# EAGLE design IronDriverInterfaceRevA (EAGLE 6.1)
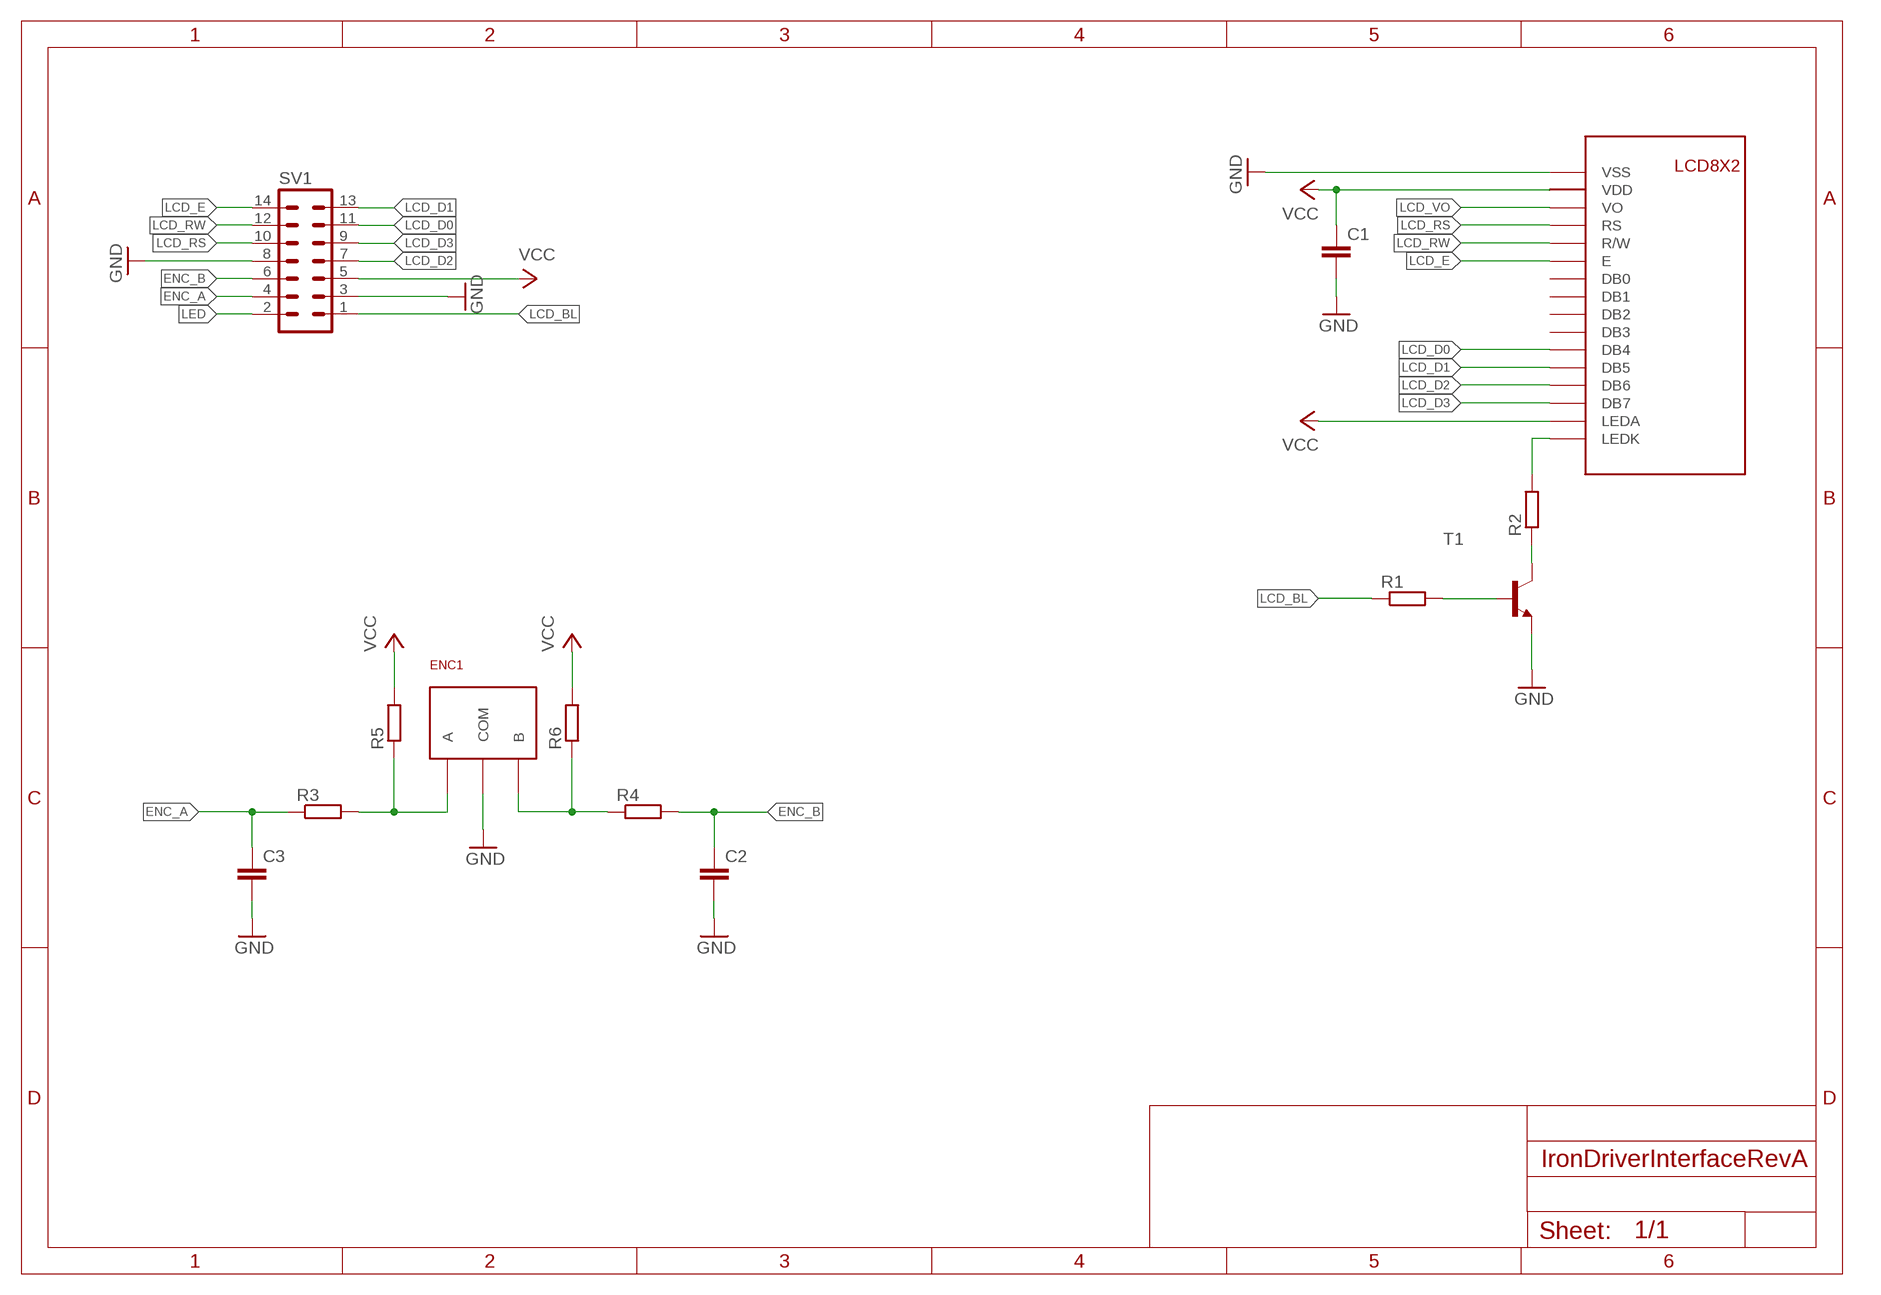
[diagram p0: schematic, sheet 1]

## Parts
C1  C-EUC0805  [C0805]
C2  C-EUC0805  [C0805]
C3  C-EUC0805  [C0805]
ENC1  ENCODER  [ENCODER_FOOTPRINT]
LCD1  HC0821  [LCD0821_FOOTPRINT]
R1  R-EU_R0805  [R0805]
R2  R-EU_R0805  [R0805]
R3  R-EU_R0805  [R0805]
R4  R-EU_R0805  [R0805]
R5  R-EU_R0805  [R0805]
R6  R-EU_R0805  [R0805]
SV1  MA07-2  [MA07-2]
T1  MMBT3904LT1-NPN-SOT23-BEC  [SOT23-BEC]

## Nets
ENC_A: C3.1 R3.1 SV1.4
ENC_B: C2.1 R4.2 SV1.6
GND: C1.2 C2.2 C3.2 ENC1.P$2(COM) LCD1.P$1(VSS) SV1.3 SV1.8 T1.E
LCD_BL: R1.1 SV1.1
LCD_D0: LCD1.P$11(DB4) SV1.11
LCD_D1: LCD1.P$12(DB5) SV1.13
LCD_D2: LCD1.P$13(DB6) SV1.7
LCD_D3: LCD1.P$14(DB7) SV1.9
LCD_E: LCD1.P$6(E) SV1.14
LCD_RS: LCD1.P$4(RS) SV1.10
LCD_RW: LCD1.P$5(R/W) SV1.12
LCD_VO: LCD1.P$3(VO)
LED: SV1.2
N$1: LCD1.P$16(LEDK) R2.2
N$2: R2.1 T1.C
N$3: R1.2 T1.B
N$16: ENC1.P$1(A) R3.2 R5.1
N$17: ENC1.P$3(B) R4.1 R6.1
VCC: C1.1 LCD1.P$2(VDD) LCD1.P$15(LEDA) R5.2 R6.2 SV1.5
Unconnected: LCD1.P$7(DB0) LCD1.P$8(DB1) LCD1.P$9(DB2) LCD1.P$10(DB3)

## Library data of the parts
C1-C3 = rcl:C-EU: CAPACITOR, European symbol
ENC1 = IronDriverLibrary:ENCODER: Rotary Encoder Digikey: P12332-ND
LCD1 = IronDriverLibrary:HC0821: LCD 8x2 HC0821
R1-R6 = rcl:R-EU_: RESISTOR, European symbol
SV1 = con-lstb:MA07-2: PIN HEADER; OC_FARNELL: unknown; OC_NEWARK: unknown
T1 = transistor:*-NPN-: NPN Transistror BF959 corrected 2008.03.06

## Board
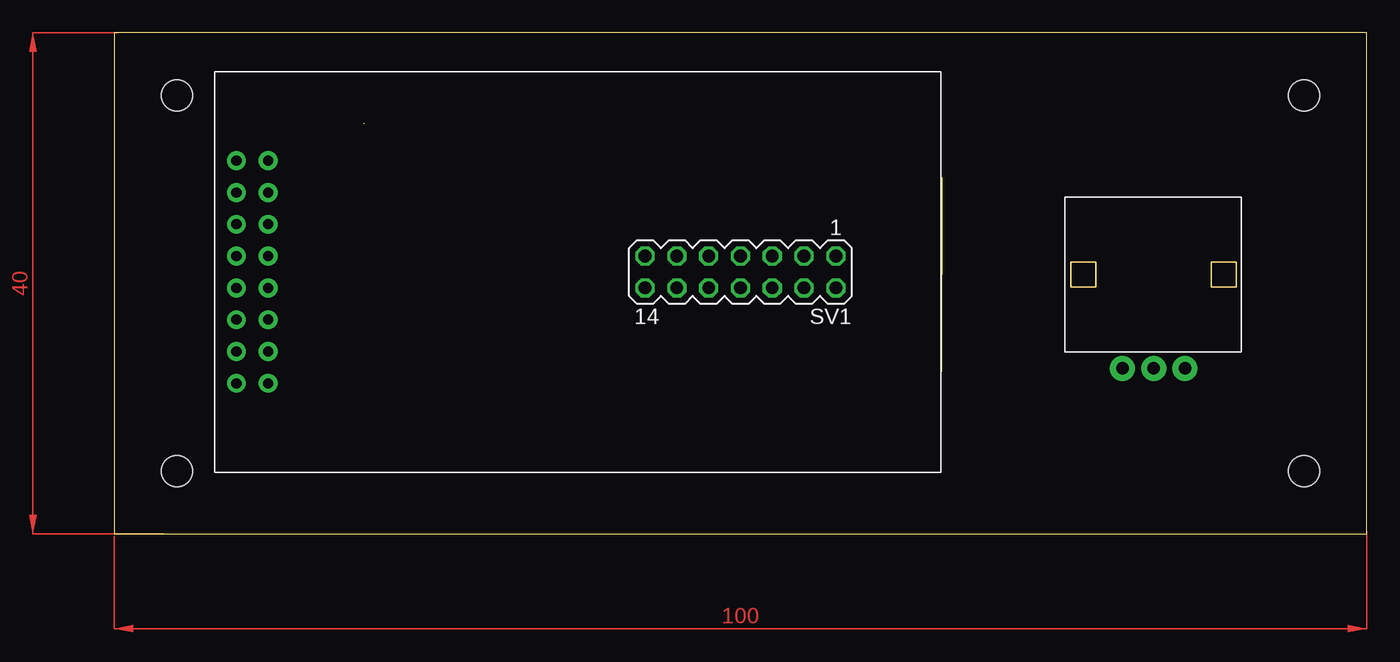
[diagram p1: board, top side]
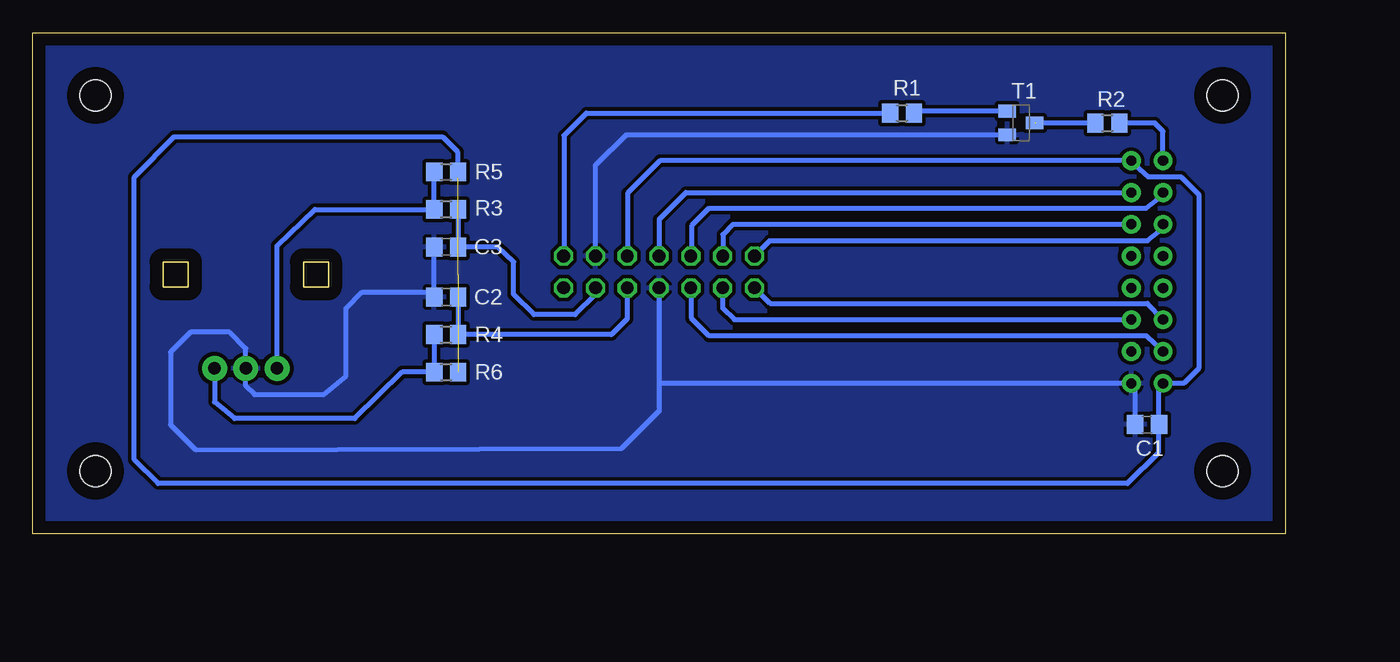
[diagram p2: board, bottom side, seen from below]

Size 100 x 40 mm. Coordinates in mm from the lower left corner, seen from the top.
Outline: 0,0 100,0 100,40 0,40 0,0
Copper layers (1*16): Top 0.035mm / dielectric 1.5mm / Bottom 0.035mm
Design rules: minimum track width 10mil, minimum drill 24mil, track to track 8mil, track to pad 8mil, pad to pad 8mil, via to via 8mil, smd to smd 8mil, copper to edge 40mil, drill to drill 8mil, minimum pad ring 10mil, minimum via ring 8mil, stop-mask expansion 4mil, vias tented up to drill 0mil, thermal gap 10mil
Holes 2.5 mm at 5,5 5,35 95,35 95,5

### Footprints (pad centres in the part's own frame; a part is rotated, then mirrored left to right if it is on the bottom)
C0805 = smd 1.3 x 1.5: 1 -0.95,0; 2 0.95,0
ENCODER_FOOTPRINT = drill 1 pad 2: P$1 -2.5,-7.5; P$2 0,-7.5; P$3 2.5,-7.5
LCD0821_FOOTPRINT = drill 0.8 pad 1.5: P$1 -24.71,-8.89; P$2 -27.25,-8.89; P$3 -24.71,-6.35; P$4 -27.25,-6.35; P$5 -24.71,-3.81; P$6 -27.25,-3.81; P$7 -24.71,-1.27; P$8 -27.25,-1.27; P$9 -24.71,1.27; P$10 -27.25,1.27; P$11 -24.71,3.81; P$12 -27.25,3.81; P$13 -24.71,6.35; P$14 -27.25,6.35; P$15 -24.71,8.89; P$16 -27.25,8.89
R0805 = smd 1.3 x 1.5: 1 -0.95,0; 2 0.95,0
MA07-2 = drill 1.016 octagon: 1 -7.62,-1.27; 2 -7.62,1.27; 3 -5.08,-1.27; 4 -5.08,1.27; 5 -2.54,-1.27; 6 -2.54,1.27; 7 0,-1.27; 8 0,1.27; 9 2.54,-1.27; 10 2.54,1.27; 11 5.08,-1.27; 12 5.08,1.27; 13 7.62,-1.27; 14 7.62,1.27
SOT23-BEC = smd 1 x 1.4: B -0.95,-1.1; C 0,1.1; E 0.95,-1.1

### Placement (x,y rotation side)
C1  11.03,8.72 180 bottom
C2  67,18.9 180 bottom
C3  67,22.9 180 bottom
ENC1  83,20.7 0 top
LCD1  37,20.9 0 top
R1  30.6,33.6 0 bottom
R2  14.2,32.8 0 bottom
R3  67,25.9 180 bottom
R4  67,15.9 0 bottom
R5  67,28.9 0 bottom
R6  67,12.9 0 bottom
SV1  50,20.9 180 top
T1  21.1,32.8 270 bottom

### Tracks (layer width: path | path; a pad name or v marks a point on that pad's centre or on a via)
ENC_A
  Bottom 0.406: R3.1 C3.1 62.9,22.9 61.6,21.7 61.6,19.1 60,17.5 56.7,17.5 55.08,19.12 SV1.4
ENC_B
  Bottom 0.406: C2.1 R4.2 53.8,15.9 52.54,17.16 SV1.6
GND
  Bottom 0.406: C1.2 11.98,11.4 LCD1.P$1 49.89,12.01 50,11.9 | 49.93,19.63 SV1.8 50,11.9 | SV1.3 55.08,29.42 52.65,31.85 T1.E | C3.2 C2.2 68.05,19.3 73.7,19.3 75,18 75,12.6 76.8,11.1 82.3,11.1 83,11.8 ENC1.P$2 83,14.8 84.3,16.1 87.4,16.1 89,14.5 89,8.7 87,6.7 53,6.8 50,9.8 50,11.9
  pour Bottom (isolate 0.305): 0,40 0,0 100,0 100,40
LCD_BL
  Bottom 0.406: R1.1 55.8,33.6 57.6,31.8 57.6,22.19 SV1.1
LCD_D0
  Bottom 0.406: SV1.11 44.9,22.19 44.9,23.9 44.09,24.71 LCD1.P$11
LCD_D1
  Bottom 0.406: LCD1.P$12 9.75,24.35 11,23.4 41.15,23.4 SV1.13
LCD_D2
  Bottom 0.406: SV1.7 50,25.1 47.85,27.25 LCD1.P$13
LCD_D3
  Bottom 0.406: LCD1.P$14 9.85,26.95 11.1,26 46,26 47.4,24.6 47.4,22.23 SV1.9
LCD_E
  Bottom 0.406: LCD1.P$6 10.99,18.39 41.14,18.39 SV1.14
LCD_RS
  Bottom 0.406: LCD1.P$4 11.1,15.8 46,15.8 47.4,17.2 47.4,19.57 SV1.10
LCD_RW
  Bottom 0.406: SV1.12 44.9,19.61 44.9,18 43.99,17.09 LCD1.P$5
N$1
  Bottom 0.406: LCD1.P$16 9.75,32.15 10.4,32.8 R2.2
N$2  (1 unrouted)
  Bottom 0.406: R2.1 19.9,32.8 20,32.7
N$3
  Bottom 0.406: T1.B 29.5,33.75 R1.2
N$16
  Bottom 0.406: R5.1 R3.2 77.5,25.9 80.5,23 ENC1.P$1
N$17
  Bottom 0.406: R4.1 R6.1 70.5,12.9 74.3,9.2 83.9,9.2 85.5,10.5 ENC1.P$3
VCC  (1 unrouted)
  Bottom 0.406: SV1.5 52.5,22.21 52.5,27.2 49.91,29.79 LCD1.P$15 11.99,29.49 10.9,28.5 8.3,28.5 6.9,27.1 6.9,13.2 8.1,12 LCD1.P$2 10.08,11.68 C1.1 10.1,8.7 10.1,6.5 12.6,4 90,4 91.9,5.9 91.9,28.5 88.7,31.7 67.3,31.7 66.1,30.5 66.1,28.45 R5.2
(copper drawn outside any net)
  shapes: Top area x2